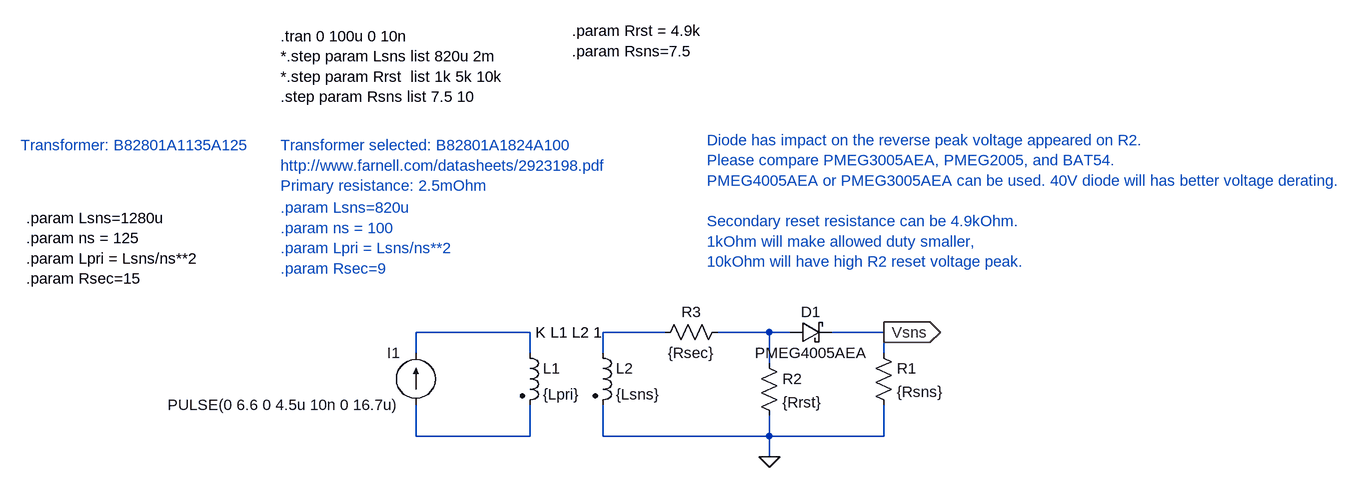
[diagram p0: schematic current_transformer_sense.asc]
current_transformer_sense.asc, the LTspice schematic file:
Version 4
SHEET 1 1936 680
WIRE 144 112 -32 112
WIRE 352 112 256 112
WIRE 512 112 432 112
WIRE 544 112 512 112
WIRE 688 112 608 112
WIRE -32 144 -32 112
WIRE 144 144 144 112
WIRE 256 144 256 112
WIRE 688 144 688 112
WIRE 512 160 512 112
WIRE -32 272 -32 224
WIRE 144 272 144 224
WIRE 144 272 -32 272
WIRE 256 272 256 224
WIRE 512 272 512 240
WIRE 512 272 256 272
WIRE 688 272 688 224
WIRE 688 272 512 272
WIRE 512 304 512 272
FLAG 512 304 0
FLAG 688 112 Vsns
IOPIN 688 112 Out
SYMBOL ind2 128 128 R0
SYMATTR InstName L1
SYMATTR Value {Lpri}
SYMATTR Type ind
SYMBOL ind2 240 128 R0
SYMATTR InstName L2
SYMATTR Value {Lsns}
SYMATTR Type ind
SYMBOL res 672 128 R0
SYMATTR InstName R1
SYMATTR Value {Rsns}
SYMBOL schottky 544 128 R270
WINDOW 0 32 32 VTop 2
WINDOW 3 0 32 VBottom 2
SYMATTR InstName D1
SYMATTR Value PMEG4005AEA
SYMATTR Description Diode
SYMATTR Type diode
SYMBOL res 496 144 R0
SYMATTR InstName R2
SYMATTR Value {Rrst}
SYMBOL current -32 224 R180
WINDOW 0 24 80 Left 2
WINDOW 3 24 0 Left 2
WINDOW 123 0 0 Left 0
WINDOW 39 0 0 Left 0
SYMATTR InstName I1
SYMATTR Value PULSE(0 6.6 0 4.5u 10n 0 16.7u)
SYMBOL res 448 96 R90
WINDOW 0 0 56 VBottom 2
WINDOW 3 32 56 VTop 2
SYMATTR InstName R3
SYMATTR Value {Rsec}
TEXT -240 -80 Left 2 ;.param Lsns=820u\n.param ns = 100\n.param Lpri = Lsns/ns**2\n.param Rsec=9
TEXT 152 112 Left 2 !K L1 L2 1
TEXT -240 -344 Left 2 !.tran 0 100u 0 10n\n*.step param Lsns list 820u 2m\n*.step param Rrst  list 1k 5k 10k\n.step param Rsns list 7.5 10
TEXT 208 -352 Left 2 !.param Rrst = 4.9k\n.param Rsns=7.5
TEXT -240 -176 Left 2 ;Transformer selected: B82801A1824A100\nhttp://www.farnell.com/datasheets/2923198.pdf\nPrimary resistance: 2.5mOhm
TEXT 416 -184 Left 2 ;Diode has impact on the reverse peak voltage appeared on R2. \nPlease compare PMEG3005AEA, PMEG2005, and BAT54.\nPMEG4005AEA or PMEG3005AEA can be used. 40V diode will has better voltage derating. \n \nSecondary reset resistance can be 4.9kOhm. \n1kOhm will make allowed duty smaller, \n10kOhm will have high R2 reset voltage peak.
TEXT -632 -64 Left 2 !.param Lsns=1280u\n.param ns = 125\n.param Lpri = Lsns/ns**2\n.param Rsec=15
TEXT -640 -176 Left 2 ;Transformer: B82801A1135A125

The netlist it stands for:
* current_transformer_sense.asc
L1 N001 N004 {Lpri}
L2 N002 0 {Lsns}
R1 Vsns 0 {Rsns}
D1 N003 Vsns PMEG4005AEA
R2 N003 0 {Rrst}
I1 N004 N001 PULSE(0 6.6 0 4.5u 10n 0 16.7u)
R3 N003 N002 {Rsec}
.model D D
.lib standard.dio
* .param Lsns=820u
* .param ns = 100
* .param Lpri = Lsns/ns**2
* .param Rsec=9
K L1 L2 1
.tran 0 100u 0 10n
*.step param Lsns list 820u 2m
*.step param Rrst  list 1k 5k 10k
.step param Rsns list 7.5 10
.param Rrst = 4.9k
.param Rsns=7.5
* Transformer selected: B82801A1824A100
* http://www.farnell.com/datasheets/2923198.pdf
* Primary resistance: 2.5mOhm
* Diode has impact on the reverse peak voltage appeared on R2.
* Please compare PMEG3005AEA, PMEG2005, and BAT54.
* PMEG4005AEA or PMEG3005AEA can be used. 40V diode will has better voltage derating.
* Secondary reset resistance can be 4.9kOhm.
* 1kOhm will make allowed duty smaller,
* 10kOhm will have high R2 reset voltage peak.
.param Lsns=1280u
.param ns = 125
.param Lpri = Lsns/ns**2
.param Rsec=15
* Transformer: B82801A1135A125
.backanno
.end